# Altium schematic sheet Converti_Alim.SchDoc: CONVERSION DES ALIMENTATIONS D'ENTREES
size A4; Date: 26/04/2026; CheckedBy: P. FISCHER; Author: P. FISCHER; CompanyName: LE GROUPE DE 5; DrawnBy: P. FISCHER; DocumentNumber: SCH_CARTE_MONITORING_PERMANENT_0; Revision: A.0; SheetNumber: 1; SheetTotal: 7
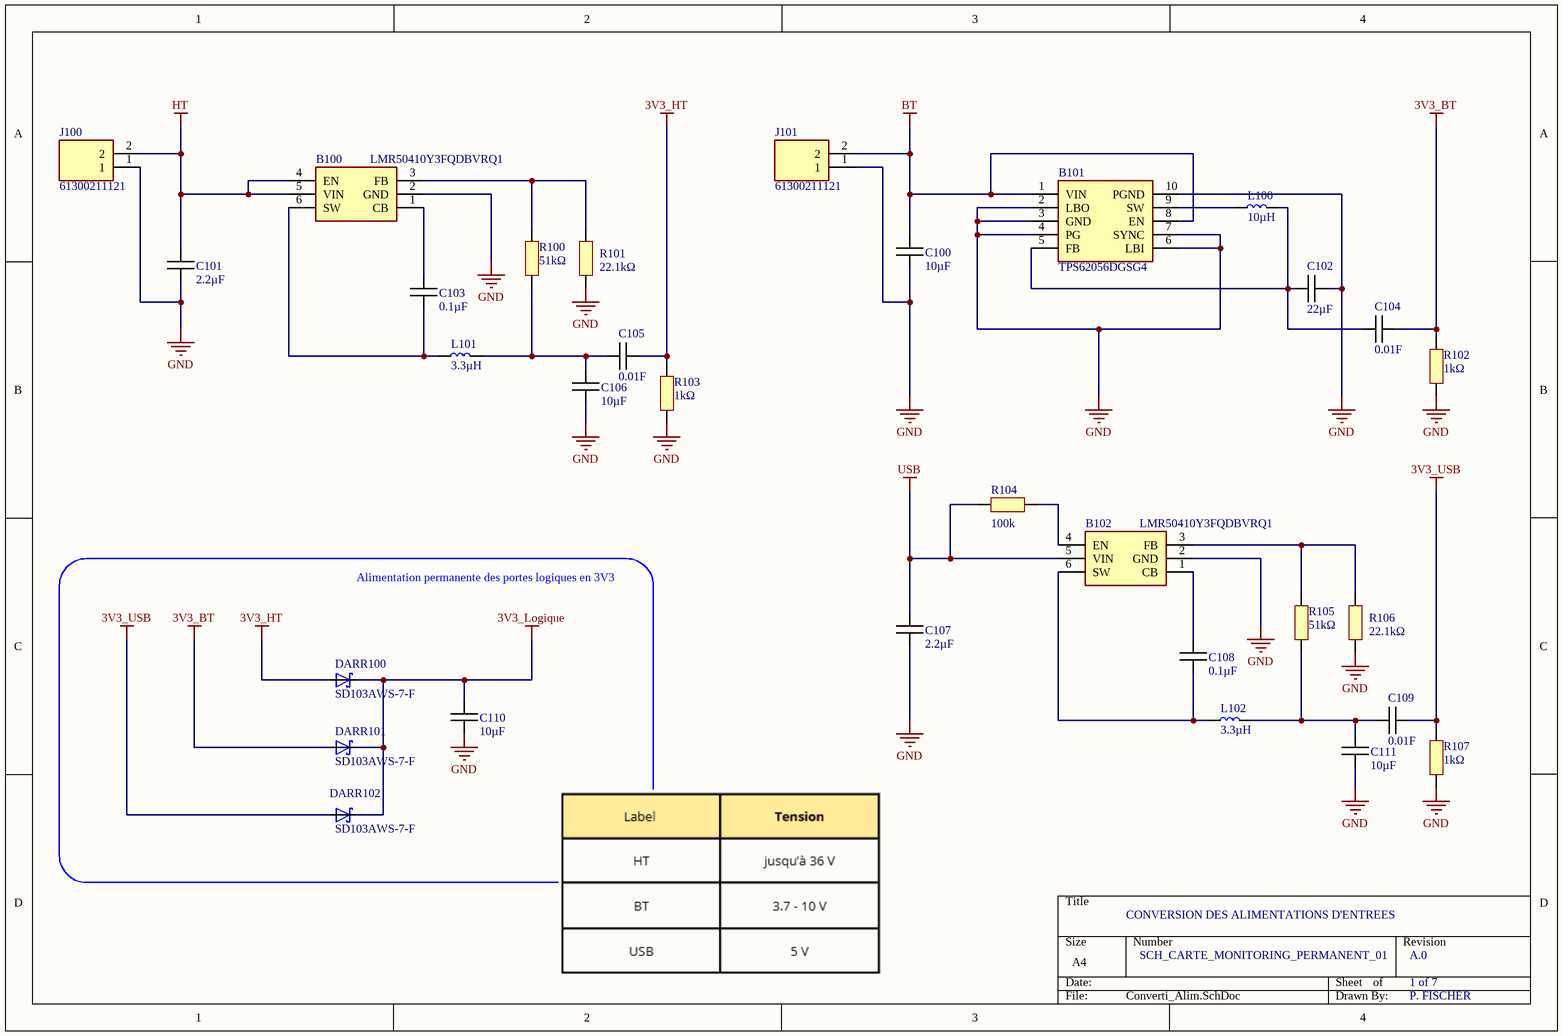
[diagram p0: Converti_Alim.SchDoc]

## Parts
B100  LMR50410Y3FQDBVRQ1  [SOT95P280X145-6N]
B101  TPS62056DGSG4  [SOP50P490X110-10N]
B102  LMR50410Y3FQDBVRQ1  [SOT95P280X145-6N]
C100  10µF  [CAPC1005X06N]
C101  2.2µF  [CAPC1005X06N]
C102  22µF  [CAPC1005X06N]
C103  0.1µF  [CAPC1005X06N]
C104  0.01F  [CAPC1005X06N]
C105  0.01F  [CAPC1005X06N]
C106  10µF  [CAPC1005X06N]
C107  2.2µF  [CAPC1005X06N]
C108  0.1µF  [CAPC1005X06N]
C109  0.01F  [CAPC1005X06N]
C110  10µF  [CAPC1005X06N]
C111  10µF  [CAPC1005X06N]
DARR100  SD103AWS-7-F  [SD103AWS-7-F]
DARR101  SD103AWS-7-F  [SD103AWS-7-F]
DARR102  SD103AWS-7-F  [SD103AWS-7-F]
J100  61300211121  [61300211121]
J101  61300211121  [61300211121]
L100  10µH  [LQPC1005X06N]
L101  3.3µH  [LQPC1005X06N]
L102  3.3µH  [LQPC1005X06N]
R100  51kΩ  [RESC1005X06N]
R101  22.1kΩ  [RESC1005X06N]
R102  1kΩ  [RESC1005X06N]
R103  1kΩ  [RESC1005X06N]
R104  100k  [RESC1005X06N]
R105  51kΩ  [RESC1005X06N]
R106  22.1kΩ  [RESC1005X06N]
R107  1kΩ  [RESC1005X06N]

## Blocks framed on the sheet
Alimentation permanente des portes logiques en 3V3: C110 DARR100-DARR102

## Nets
3V3_BT: C104.2 DARR101.2(A) R102.2
3V3_HT: C105.2 DARR100.2(A) R103.2
3V3_Logique: C110.1 DARR100.1(C) DARR101.1(C) DARR102.1(C)
3V3_USB: C109.2 DARR102.2(A) R107.2
BT: B101.1(VIN) B101.8(EN) C100.1 J101.2
GND: B100.2(GND) B101.2(LBO) B101.3(GND) B101.4(PG) B101.6(LBI) B101.7(SYNC) B101.10(PGND) B102.2(GND) C100.2 C101.2 C102.2 C106.2 C107.2 C110.2 C111.2 J100.1 J101.1 R101.1 R102.1 R103.1 R106.1 R107.1
HT: B100.4(EN) B100.5(VIN) C101.1 J100.2
USB: B102.5(VIN) C107.1 R104.1
NetB100_1: B100.1(CB) C103.1
NetB100_3: B100.3(FB) R100.2 R101.2
NetB100_6: B100.6(SW) C103.2 L101.1
NetB101_5: B101.5(FB) C102.1 C104.1 L100.2
NetB101_9: B101.9(SW) L100.1
NetB102_1: B102.1(CB) C108.1
NetB102_3: B102.3(FB) R105.2 R106.2
NetB102_4: B102.4(EN) R104.2
NetB102_6: B102.6(SW) C108.2 L102.1
NetC105_1: C105.1 C106.1 L101.2 R100.1
NetC109_1: C109.1 C111.1 L102.2 R105.1

## Library data of the parts
B100 B102 = LMR50410Y3FQDBVRQ1: Régulateurs de tension de commutation Automotive qualified SIMPLE SWITCHER 4-V to 36-V, 1-A synchronous step-down converter 6-SOT-23 -40 to 150; Manufacturer_Name: Texas Instruments; Manufacturer_Part_Number: LMR50410Y3FQDBVRQ1; Mouser Part Number: 595-R50410Y3FQDBVRQ1
B101 = TPS62056DGSG4: TEXAS INSTRUMENTS - TPS62056DGSG4 - Synchronous Buck (Step Down) Switching Regulator, Fixed, 2.7V-10Vin, 3.3V/0.8A out, 850kHz, VSSOP-10; Manufacturer_Name: Texas Instruments; Manufacturer_Part_Number: TPS62056DGSG4; Mouser Part Number: 595-TPS62056DGSG4
C100-C111 = Capacitor
DARR100-DARR102 = SD103AWS-7-F: Diode Array 3 Independent Schottky 40V 175mA Surface Mount 6-TSSOP, SC-88, SOT-363
J100 J101 = 61300211121: WURTH ELEKTRONIK - 61300211121 - HEADER, 2.54MM, PIN, THT, VERTICAL, 2WAY
L100-L102 = Bobine
R100-R107 = Resistor